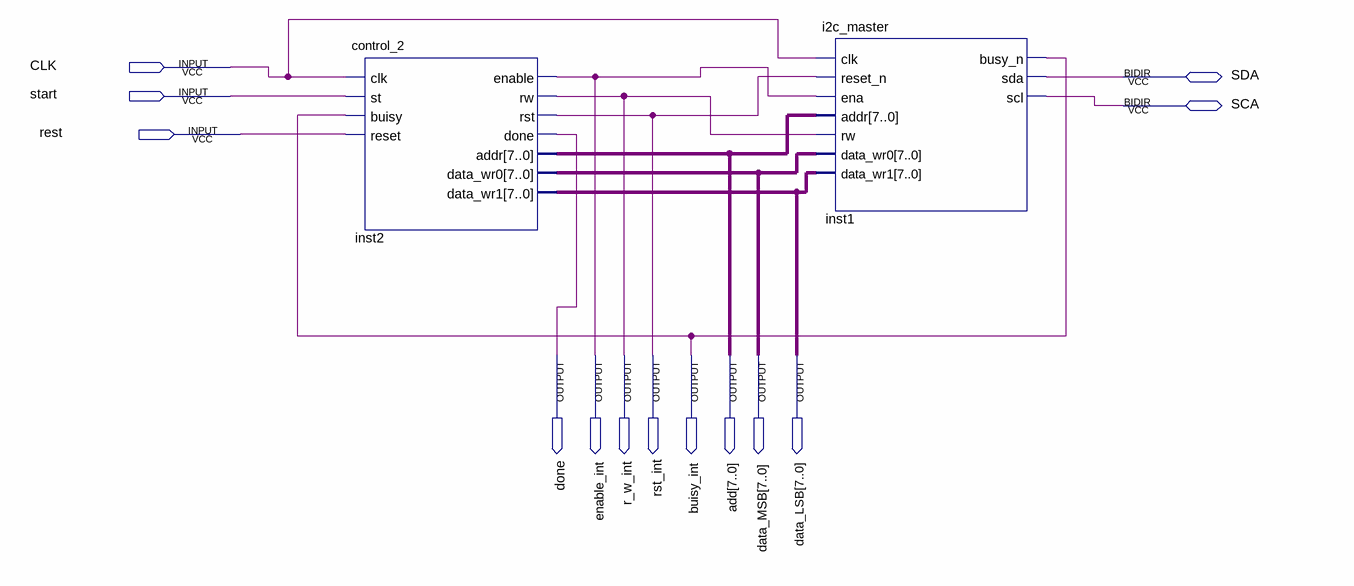
[diagram p0: schematic sheet]
// Quartus schematic Block1.bdf as structural Verilog: 2 symbols, 13 pins
module Block1 (
  input  CLK,
  input  start,
  input  rest,
  inout  SDA,
  inout  SCA,
  output done,
  output enable_int,
  output r_w_int,
  output rst_int,
  output buisy_int,
  output [7:0] add,
  output [7:0] data_MSB,
  output [7:0] data_LSB
);

  control_2 inst2 (
    .clk(CLK), .st(start), .buisy(buisy_int), .reset(rest), .enable(enable_int), .rw(r_w_int), .rst(rst_int),
    .done(done), .addr(add), .data_wr0(data_MSB), .data_wr1(data_LSB));
  i2c_master inst1 (
    .clk(CLK), .reset_n(rst_int), .ena(enable_int), .addr(add), .rw(r_w_int), .data_wr0(data_MSB),
    .data_wr1(data_LSB), .busy_n(buisy_int), .sda(SDA), .scl(SCA));
endmodule
